# Altium schematic sheet 5V_Inputs.SchDoc: RP2040 CNC
size B; Author: AM; CompanyName: Expatria Technologies; DrawnBy: A.Marles; Engineer: AM; Organization: Expatria Technolgoies; DocumentNumber: 4; SheetNumber: 6; SheetTotal: 9
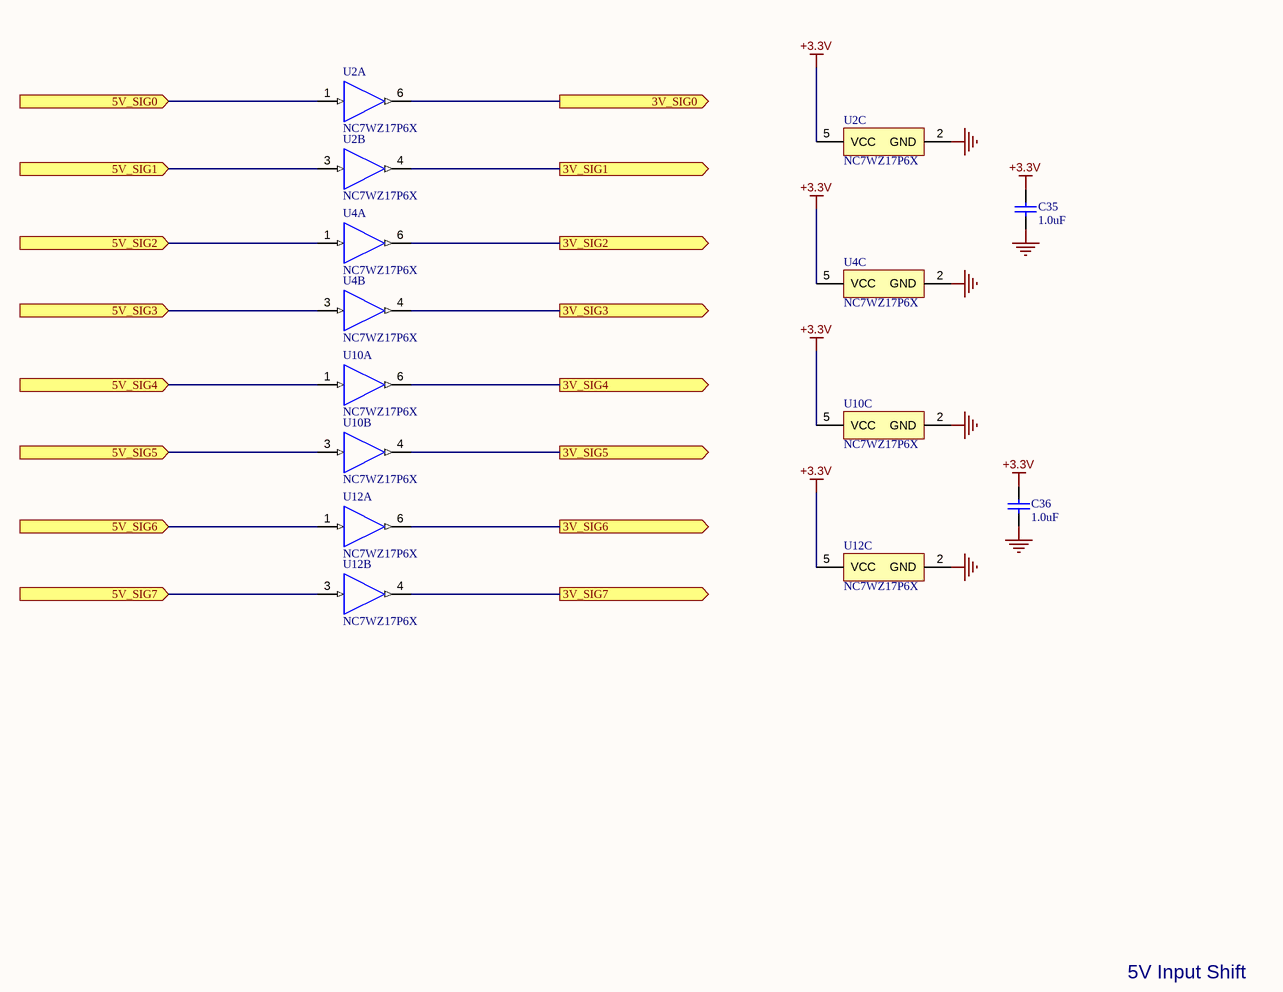
[diagram p0: 5V_Inputs.SchDoc]

## Parts
C35  1.0uF  [0402_C]
C36  1.0uF  [0402_C]
U2  NC7WZ17P6X  [FAIR-SC70-6_V]  (parts A,B,C of 3)
U4  NC7WZ17P6X  [FAIR-SC70-6_V]  (parts A,B,C of 3)
U10  NC7WZ17P6X  [FAIR-SC70-6_V]  (parts A,B,C of 3)
U12  NC7WZ17P6X  [FAIR-SC70-6_V]  (parts A,B,C of 3)

## Ports
3V_SIG0 (out), 3V_SIG1 (out), 3V_SIG2 (out), 3V_SIG3 (out), 3V_SIG4 (out), 3V_SIG5 (out), 3V_SIG6 (out), 3V_SIG7 (out), 5V_SIG0 (in), 5V_SIG1 (in), 5V_SIG2 (in), 5V_SIG3 (in), 5V_SIG4 (in), 5V_SIG5 (in), 5V_SIG6 (in), 5V_SIG7 (in)

## Nets
+3.3V: C35.1 C36.1 U2.5(VCC) U4.5(VCC) U10.5(VCC) U12.5(VCC)
GND: C35.2 C36.2 U2.2(GND) U4.2(GND) U10.2(GND) U12.2(GND)
3V_SIG0: U2.6(Y1) ; port 3V_SIG0
3V_SIG1: U2.4(Y2) ; port 3V_SIG1
3V_SIG2: U4.6(Y1) ; port 3V_SIG2
3V_SIG3: U4.4(Y2) ; port 3V_SIG3
3V_SIG4: U10.6(Y1) ; port 3V_SIG4
3V_SIG5: U10.4(Y2) ; port 3V_SIG5
3V_SIG6: U12.6(Y1) ; port 3V_SIG6
3V_SIG7: U12.4(Y2) ; port 3V_SIG7
5V_SIG0: U2.1(A1) ; port 5V_SIG0
5V_SIG1: U2.3(A2) ; port 5V_SIG1
5V_SIG2: U4.1(A1) ; port 5V_SIG2
5V_SIG3: U4.3(A2) ; port 5V_SIG3
5V_SIG4: U10.1(A1) ; port 5V_SIG4
5V_SIG5: U10.3(A2) ; port 5V_SIG5
5V_SIG6: U12.1(A1) ; port 5V_SIG6
5V_SIG7: U12.3(A2) ; port 5V_SIG7

## Notes on the sheet
- 5V Input Shift
- SHEET
- Expatria Technologies
- 1136 Glade Court
- Port Coquitlam, BC V3B 1R5
- PROJECT
- SIZE
- ENGR
- MODIFIED
- DOCUMENT
- REV
- Copyright Expatria Technologies 2023. This document describes Open Hardware and is licensed under the CERN-OHL-S v2. No warranty is implied or expressed.
- EMAIL: INFO@EXPATRIA.CA
- B
- /

## Library data of the parts
C35 C36 = 0402 1.0uF (105) 10% 25V: Chip capacitor; Manufacturer: Samsung Electro-Mechanics; PartNumber: CL05A105KA5NQNC; Capacitance: 1uF; Tolerance: 10%; Voltage: 25V; ComponentLink1Description: Supplier link; ComponentLink1URL: http://www.szlcsc.com/product/details_53938.html; Package: 0402; Supplier: LC; SuppliersPartNumber: C52923
U2 U4 U10 U12 = CMP-2000-06825-1: TinyLogic(R) UHS Dual Buffer with Schmitt Trigger Input, 1.65 to 5.5 V, -40 to 85 degC, 6-Pin SOT23 (SC70), RoHS, Tape and Reel; Manufacturer: Fairchild Semiconductor; Operating Supply Voltage (Typ): 1.8/2.5/3.3/5V; Number of Inputs: 2; Polarity: Non-Inverting; Quiescent Current: 1uA; Propagation Delay Time: 15.8ns; Operating Supply Voltage (Min): 1.65V; Output Type: Standard; Logic Family: TinyLogicUHS; Low Level Output Current: 32mA; Operating Supply Voltage (Max): 5.5V; Rad Hardened: No; High Level Output Current: -32mA; Logical Function: SchmitTrigBuffer; Operating Temperature Classification: Industrial; Mounting: SurfaceMount; Package Description: 6-Pin Small Outline Transistor, Body 2 x 1.25 mm, Pitch 0.65 mm; Datasheet Version: Rev. 1.0.6, 01/2012; Datasheet URL: https://datasheet.ciiva.com/5701/1725704-5701892.pdf; Number of Channels: 2; Package URL: https://www.fairchildsemi.com/package-drawings/MA/MAA06A.pdf; Number of Outputs: 2; Package Reference: SC70-6; Mounting Technology: SurfaceMount; Package Type: SC-70; Packaging: TapeandReel; Technology: CMOS; Number of  Elements: 2; Pin Count: 6; Manufacturer URL: https://www.fairchildsemi.com/; Operating Temp Range: -40Cto85C